# Altium schematic sheet M.SchDoc
size Letter; DocumentNumber: 3; SheetNumber: 3; SheetTotal: 8
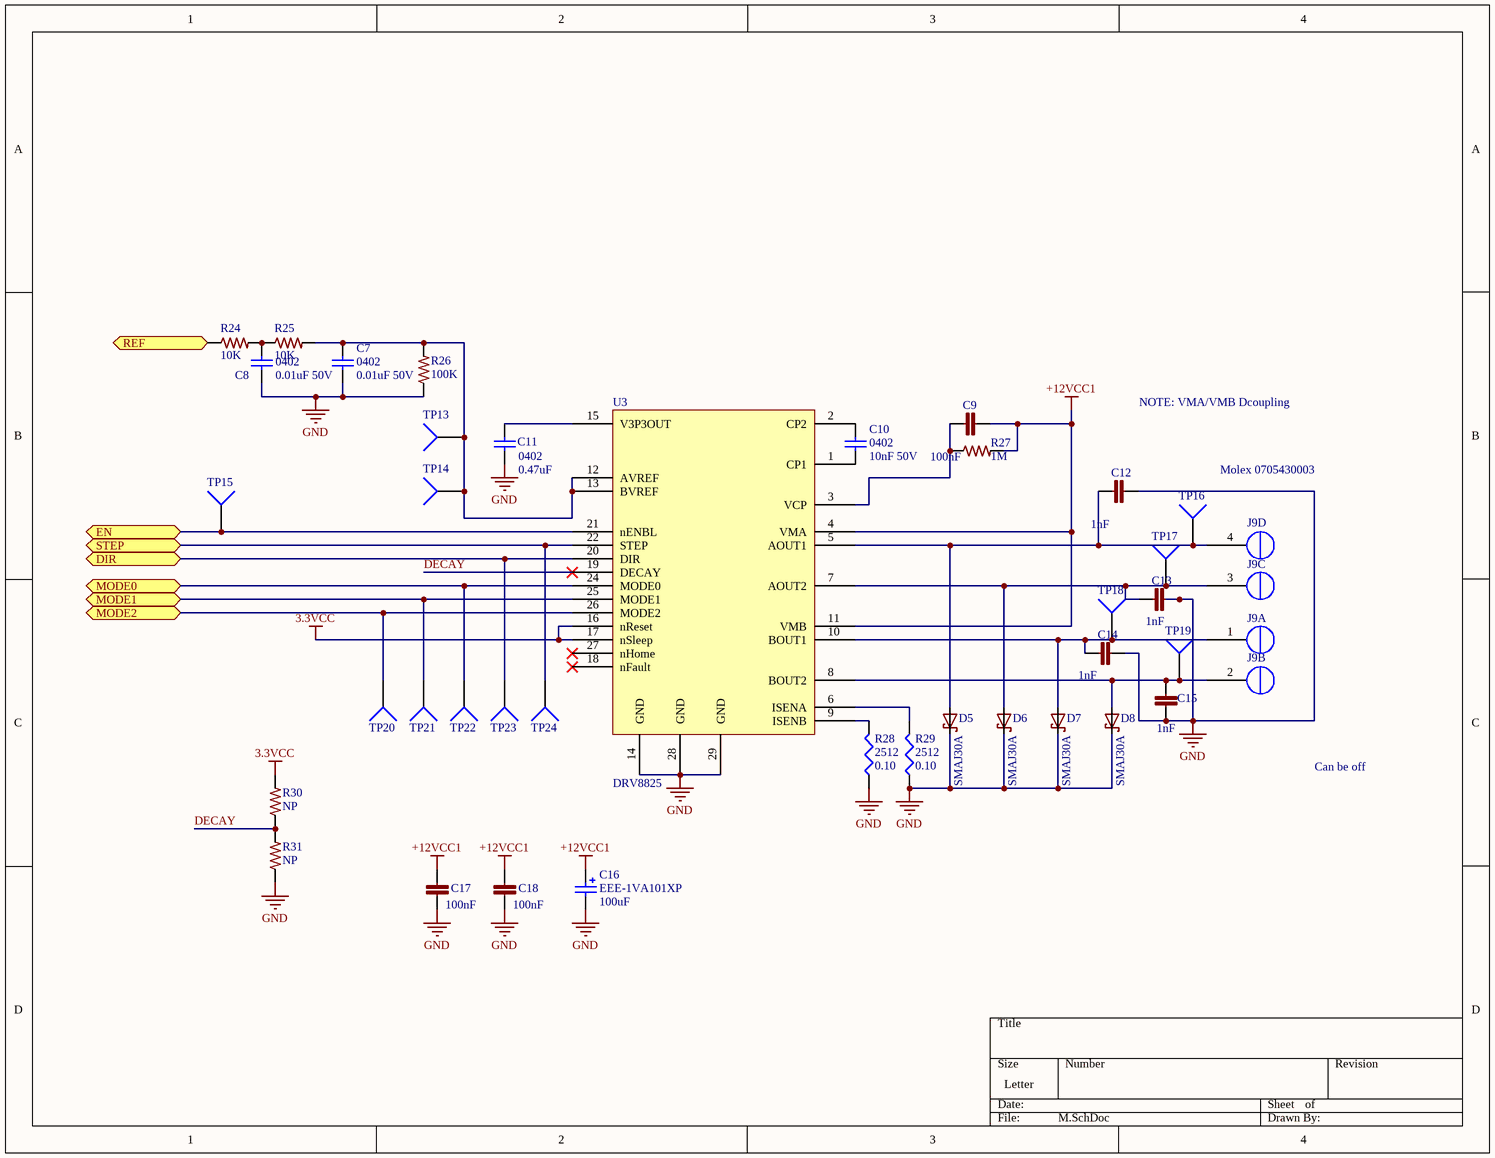
[diagram p0: M.SchDoc]

## Parts
C7  value 0.01uF 50V  [C0402]  (hidden comment: 0402)
C8  value 0.01uF 50V  [C0402]  (hidden comment: 0402)
C9  100nF  [C0402]
C10  value 10nF 50V  [C0402]  (hidden comment: 0402)
C11  value 0.47uF  [C0402]  (hidden comment: 0402)
C12  1nF  [C0603]
C13  1nF  [C0603]
C14  1nF  [C0603]
C15  1nF  [C0603]
C16  EEE-1VA101XP  value 100uF  [EEE-1VA101XP]
C17  100nF  [C0603]
C18  100nF  [C0603]
D5  SMAJ30A  [SMA-SM]
D6  SMAJ30A  [SMA-SM]
D7  SMAJ30A  [SMA-SM]
D8  SMAJ30A  [SMA-SM]
J9  Molex 0705430003  [4POL254]  (parts A,B,C,D of 4)
R24  10K  [R0402]
R25  10K  [R0402]
R26  100K  [R0402]
R27  1M  [R0402]
R28  2512  value 0.10  [2512R-0.55]
R29  2512  value 0.10  [2512R-0.55]
R30  NP  [R0402]
R31  NP  [R0402]
TP13  TP4  [TP-2]  (value not drawn)
TP14  TP4  [TP-2]  (value not drawn)
TP15  TP4  [TP-2]  (value not drawn)
TP16  TP4  [TP-2]  (value not drawn)
TP17  TP4  [TP-2]  (value not drawn)
TP18  TP4  [TP-2]  (value not drawn)
TP19  TP4  [TP-2]  (value not drawn)
TP20  TP4  [TP-2]  (value not drawn)
TP21  TP4  [TP-2]  (value not drawn)
TP22  TP4  [TP-2]  (value not drawn)
TP23  TP4  [TP-2]  (value not drawn)
TP24  TP4  [TP-2]  (value not drawn)
U3  DRV8825  [DRV8825PWPR]

## Ports
DIR, EN, MODE0, MODE1, MODE2, REF, STEP

## Nets
3.3VCC: R30.2 U3.16(nReset) U3.17(nSleep)
+12VCC1: C9.2 C16.1 C17.1 C18.1 R27.2 U3.4(VMA) U3.11(VMB)
GND: C7.1 C8.1 C11.1 C12.2 C13.2 C14.2 C15.1 C16.2 C17.2 C18.2 D5.C D6.C D7.C D8.C R26.1 R28.1 R29.1 R31.1 U3.14(GND) U3.28(GND) U3.29(GND)
DECAY: R30.1 R31.2 U3.19(DECAY)
DIR: TP23.1 U3.20(DIR) ; port DIR
EN: TP15.1 U3.21(nENBL) ; port EN
MODE0: TP22.1 U3.24(MODE0) ; port MODE0
MODE1: TP21.1 U3.25(MODE1) ; port MODE1
MODE2: TP20.1 U3.26(MODE2) ; port MODE2
REF: R24.1 ; port REF
STEP: TP24.1 U3.22(STEP) ; port STEP
NetC7_2: C7.2 R25.2 R26.2 TP13.1 TP14.1 U3.12(AVREF) U3.13(BVREF)
NetC8_2: C8.2 R24.2 R25.1
NetC9_1: C9.1 R27.1 U3.3(VCP)
NetC10_1: C10.1 U3.1(CP1)
NetC10_2: C10.2 U3.2(CP2)
NetC11_2: C11.2 U3.15(V3P3OUT)
NetC12_1: C12.1 D5.A J9.4(OUT1B) TP16.1 U3.5(AOUT1)
NetC13_1: C13.1 D6.A J9.3(OUT1A) TP17.1 U3.7(AOUT2)
NetC14_1: C14.1 D7.A J9.1(OUT2B) TP18.1 U3.10(BOUT1)
NetC15_2: C15.2 D8.A J9.2(OUT2A) TP19.1 U3.8(BOUT2)
NetR28_2: R28.2 U3.9(ISENB)
NetR29_2: R29.2 U3.6(ISENA)

Not connected (* = marked no-connect by the designer): U3 18(nFault)* 23(NC) 27(nHome)*

## Notes on the sheet
- NOTE: VMA/VMB Dcoupling
- Can be off

## Library data of the parts
C7 C8 = GRM155R71H103JA88D: CAP CER 10000PF 50V X7R 0402; MFR: Murata; Tolerance: 10%; Voltage: 6.3VDC; Published: 10 - Dec - 2014; LatestRevisionDate: 10 - Dec - 2014; LatestRevisionNote: Ultimachine Footprint Added; Publisher: Ultimachine; Component Type: Chip Capacitor; MFR Part #: GRM155R71H103JA88D; Part Description: CAP CER 10000PF 50V X7R 0402; Mounting Type: SMT 0402; Datasheet: http://search.murata.co.jp/Ceramy/image/img/A01X/G101/ENG/GRM155R71H103JA88-01.pdf; Height: 0.5 ±0.05mm; Digikey #: 490-7763-1-ND; PackageReference: 0402
C9 = GRM155R71C104KA88D: CAP CER 0402 100nF 16V 10% X7R; LastRevisionNote: ImportComponents; Published: 23-Apr-2014; Publisher: UltiMachine; LastRevisionDate: 23-Apr-2014; ManufacturerPartNumber: GRM155R71C104KA88D; VALUE: 100nF
C10 = GRM155R71H103JA88D: CAP CER 10nF 50V X7R 0402; MFR: Murata; Part Description: CAP CER 10000PF 50V X7R 0402; Tolerance: 10%; Voltage: 6.3VDC; Published: 10 - Dec - 2014; LatestRevisionDate: 10 - Dec - 2014; LatestRevisionNote: Ultimachine Footprint Added; Publisher: Ultimachine; Component Type: Chip Capacitor; MFR Part #: GRM155R71H103JA88D; Mounting Type: SMT 0402; Datasheet: http://search.murata.co.jp/Ceramy/image/img/A01X/G101/ENG/GRM155R71H103JA88-01.pdf; Height: 0.5 ±0.05mm; Digikey #: 490-7763-1-ND; PackageReference: 0402
C11 = GRM155R60J474KE19D: 0.47uF 6.3v C0402 - GRM155R60J474KE19D; MFR: Murata; Part Description: CAP CER 0.47UF 6.3V 10% X5R 0402; Tolerance: 10%; Voltage: 6.3VDC; Published: 10 - Dec - 2014; LatestRevisionDate: 10 - Dec - 2014; LatestRevisionNote: Ultimachine Footprint Added; Publisher: Ultimachine; Component Type: Chip Capacitor; MFR Part #: GRM155R60J474KE19D; Mounting Type: SMT 0402; Datasheet: http://search.murata.co.jp/Ceramy/image/img/A01X/G101/ENG/GRM155R60J474KE19-01.pdf; Height: 0.5 ±0.05mm; PackageReference: 0402
C12-C15 = C0603C102K5RACTU: CAP CER 0603  1nF 50v 10% X7R; LastRevisionNote: ImportComponents; Published: 23-Apr-2014; Publisher: UltiMachine; LastRevisionDate: 23-Apr-2014; ManufacturerPartNumber: C0603C102K5RACTU; VALUE: 1nF
C16 = EEE-1VA101XP: CAP ALUM 100UF 35V 20% SMD; Manufacture: Panasonic; Digikey Part #: PCE3951CT-ND; Price: $0.63; Mount Type: SMT Panasonic VS D Series; Status: Active; Height: 7.70mm; Datasheet: http://industrial.panasonic.com/www-cgi/jvcr13pz.cgi?E+PZ+3+ABA0002+EEE1VA101XP+7+WW; Manufacture Part #: EEE-1VA101XP
C17 C18 = C0603C104K5RACTU: CAP CER 0603 100nF 50V 10% X7R; LastRevisionNote: ImportComponents; Published: 23-Apr-2014; Publisher: UltiMachine; LastRevisionDate: 23-Apr-2014; ManufacturerPartNumber: C0603C104K5RACTU; VALUE: 100nF
D5-D8 = SMAJ30A: DIODE TVS 30V SMA; LastRevisionNote: ImportComponents; Published: 23-Apr-2014; Publisher: UltiMachine; LastRevisionDate: 23-Apr-2014; ManufacturerPartNumber: SMAJ30A
J9 = Molex 0705430003 Alt: Molex 4 Pin Clip Connector
R24 R25 = RC0402FR-0710KP: RES SMD 10K OHM 1% 1/16W 0402; LastRevisionNote: ImportComponents; Published: 23-Apr-2014; Publisher: UltiMachine; LastRevisionDate: 23-Apr-2014; ManufacturerPartNumber: RC0402FR-0710KP; VALUE: 10K
R26 = RC1005F104CS: RES SMD 100K OHM 1% 1/16W 0402; Manufacturer: Samsung; LastRevisionNote: ImportComponents; Digilkey #: 1276-3432-1-ND; Published: 23-Apr-2014; Publisher: UltiMachine; LastRevisionDate: 23-Apr-2014; ManufacturerPartNumber: RC1005F104CS; VALUE: 100K
R27 = ERJ2GEJ105X: RES 0402 1M 100mW 5%; LastRevisionNote: ImportComponents; Published: 23-Apr-2014; Publisher: UltiMachine; LastRevisionDate: 23-Apr-2014; ManufacturerPartNumber: ERJ2GEJ105X; VALUE: 1M
R28 R29 = CSRN2512FTR100: RES SMD 0.1 OHM 1% 2W 2512; MFR: Stackpole ELectronics Inc; PackageReference: 2512; MFR #: CSRN2512FTR100; Digikey #: CSRN2512FTR100TR-ND; PDF: http://www.seielect.com/catalog/SEI-CSR_CSRN.pdf
R30 R31 = Resistor: LastRevisionNote: ImportComponents; Published: 23-Apr-2014; Publisher: UltiMachine; LastRevisionDate: 23-Apr-2014; VALUE: NP
TP13-TP24 = Socket: LatestRevisionDate: 17-Jul-2002; LatestRevisionNote: Re-released for DXP Platform.; Publisher: Altium Limited
U3 = DRV8825: DRV8825 Ti Stepper Driver; Manufacture: Texas Instruments; Mountining Type: SMD - Ti PowerPAD Package; Voltage: 8.2-45VDC; Cost (1000 qty): 2.25; Part Number: DRV8825PWPR; Status: In-Production; Pins: 28 Pins and one Exposed Pad; Datasheet: http://www.ti.com/lit/gpn/drv8825; Height: 1.2mm; Tolerance: N/A; Type: Stepper Driver - Integrated Circuit; Lead Free: YES